# Altium schematic sheet id_eeprom.SchDoc: Test
size A4; DrawnBy: Łukasz Przeniosło; Organization: Zachodniopomorski; Address1: Uniwersytet Technologiczny; Address2: w Szczecinie; Address3: Wydział Elektryczny; DocumentNumber: 3; Revision: 1.0; SheetNumber: 3; SheetTotal: 8
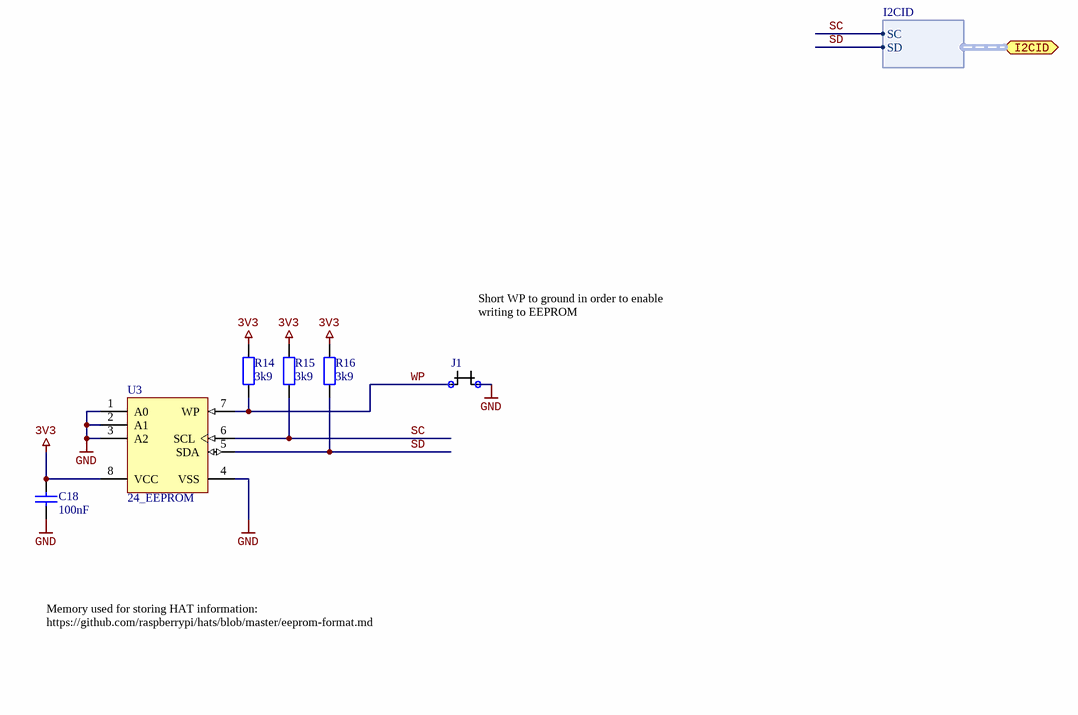
[diagram p0: id_eeprom.SchDoc]

## Parts
C18  100nF  [CAPC1608N]
J1  Jumper  [JUMPER]  (value not drawn)
R14  3k9  [RESC1608N]
R15  3k9  [RESC1608N]
R16  3k9  [RESC1608N]
U3  24_EEPROM  [SO-8_L]

## Ports
I2CID (harness I2CID)

## Harnesses
I2CID: SC, SD

## Nets
3V3: C18.2 R14.1 R15.1 R16.1 U3.8(VCC)
GND: C18.1 J1.2 U3.1(A0) U3.2(A1) U3.3(A2) U3.4(VSS)
SC: R15.2 U3.6(SCL) ; port I2CID.SC
SD: R16.2 U3.5(SDA) ; port I2CID.SD
WP: J1.1 R14.2 U3.7(WP)

## Notes on the sheet
- (near J1) Short WP to ground in order to enable writing to EEPROM
- Memory used for storing HAT information:
  https://github.com/raspberrypi/hats/blob/master/eeprom-format.md
- Title
- Size:
- Date:
- A4
- Author:
- Time:
- Sheet
- of
- File:

## Library data of the parts
C18 = Capacitor: Value: 100nF
R14-R16 = Resistor: Tolerance: 5%; Power: 0W; Value: 3k9
U3 = 24_EEPROM: 16Kbit, 400kHz, 2.5V, I2C Serial EEPROM, 8-Pin SOIC 150mil, Extended Temperature; DatasheetVersion: revA, Nov-2008; Code_JEDEC: MS-012; PackageDescription: 8-Lead Plastic Small Outline (SN) - Narrow, 3.90mm Body [SOIC]; Code_IPC: SOIC127P600-8; PackageReference: SOIC-SN8; PackageVersion: revBB, Aug-2009